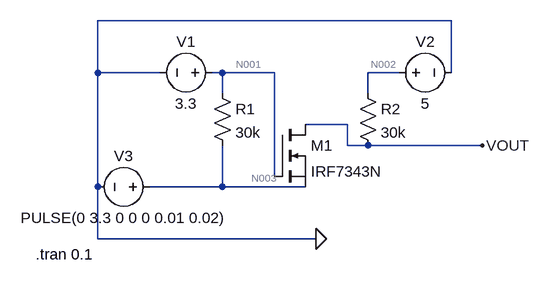
[diagram p0: schematic conversor-bidirecional.asc]
conversor-bidirecional.asc, the LTspice schematic file:
Version 4
SHEET 1 880 680
WIRE 496 0 -48 0
WIRE -48 80 -48 0
WIRE 48 80 -48 80
WIRE 144 80 128 80
WIRE 224 80 144 80
WIRE 416 80 368 80
WIRE 496 80 496 0
WIRE 144 112 144 80
WIRE 368 112 368 80
WIRE 336 160 272 160
WIRE 336 192 336 160
WIRE 368 192 336 192
WIRE 544 192 368 192
WIRE 224 240 224 80
WIRE -48 256 -48 80
WIRE 144 256 144 192
WIRE 144 256 32 256
WIRE 272 256 144 256
WIRE -48 336 -48 256
WIRE 288 336 -48 336
FLAG 544 192 VOUT
FLAG 288 336 0
SYMBOL voltage 144 80 R90
WINDOW 0 -32 56 VBottom 2
WINDOW 3 32 56 VTop 2
WINDOW 123 0 0 Left 0
WINDOW 39 0 0 Left 0
SYMATTR InstName V1
SYMATTR Value 3.3
SYMBOL voltage 400 80 R270
WINDOW 0 32 56 VTop 2
WINDOW 3 -32 56 VBottom 2
WINDOW 123 0 0 Left 0
WINDOW 39 0 0 Left 0
SYMATTR InstName V2
SYMATTR Value 5
SYMBOL voltage 48 256 R90
WINDOW 0 -32 56 VBottom 2
WINDOW 3 32 56 VTop 2
WINDOW 123 0 0 Left 0
WINDOW 39 0 0 Left 0
SYMATTR InstName V3
SYMATTR Value PULSE(0 3.3 0 0 0 0.01 0.02)
SYMBOL nmos 224 160 R0
SYMATTR InstName M1
SYMATTR Value IRF7343N
SYMBOL res 128 96 R0
SYMATTR InstName R1
SYMATTR Value 30k
SYMBOL res 352 96 R0
SYMATTR InstName R2
SYMATTR Value 30k
TEXT -144 360 Left 2 !.tran 0.1

The netlist it stands for:
* conversor-bidirecional.asc
V1 N001 0 3.3
V2 N002 0 5
V3 N003 0 PULSE(0 3.3 0 0 0 0.01 0.02)
M1 VOUT N001 N003 N003 IRF7343N
R1 N001 N003 30k
R2 N002 VOUT 30k
.model NMOS NMOS
.model PMOS PMOS
.lib standard.mos
.tran 0.1
.backanno
.end

* Results of the author's LTspice run, read from the files saved beside the schematic
* Operating Point, zero values left out:
*   V(n001) = 3.3 V
*   V(n002) = 5 V
*   V(vout) = 13.08 µV
*   Id(M1) = 166.7 µA
*   Is(M1) = -166.7 µA
*   I(R2) = 166.7 µA
*   I(R1) = 110 µA
*   I(V3) = 276.7 µA
*   I(V2) = -166.7 µA
*   I(V1) = -110 µA
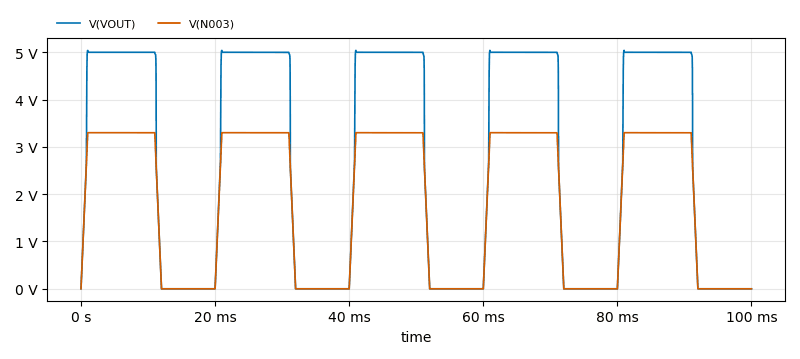
[diagram p1: Transient Analysis of conversor-bidirecional.asc, plotted from the saved traces]
* Transient Analysis, 1 run:
*   V(VOUT): min 13.08 µV, max 5.04 V, average 2.701 V, rms 3.626 V, last 13.08 µV
*   V(N003): min 0 V, max 3.3 V, average 1.815 V, rms 2.412 V, last 0 V